# Altium project PEPL.PrjPcb
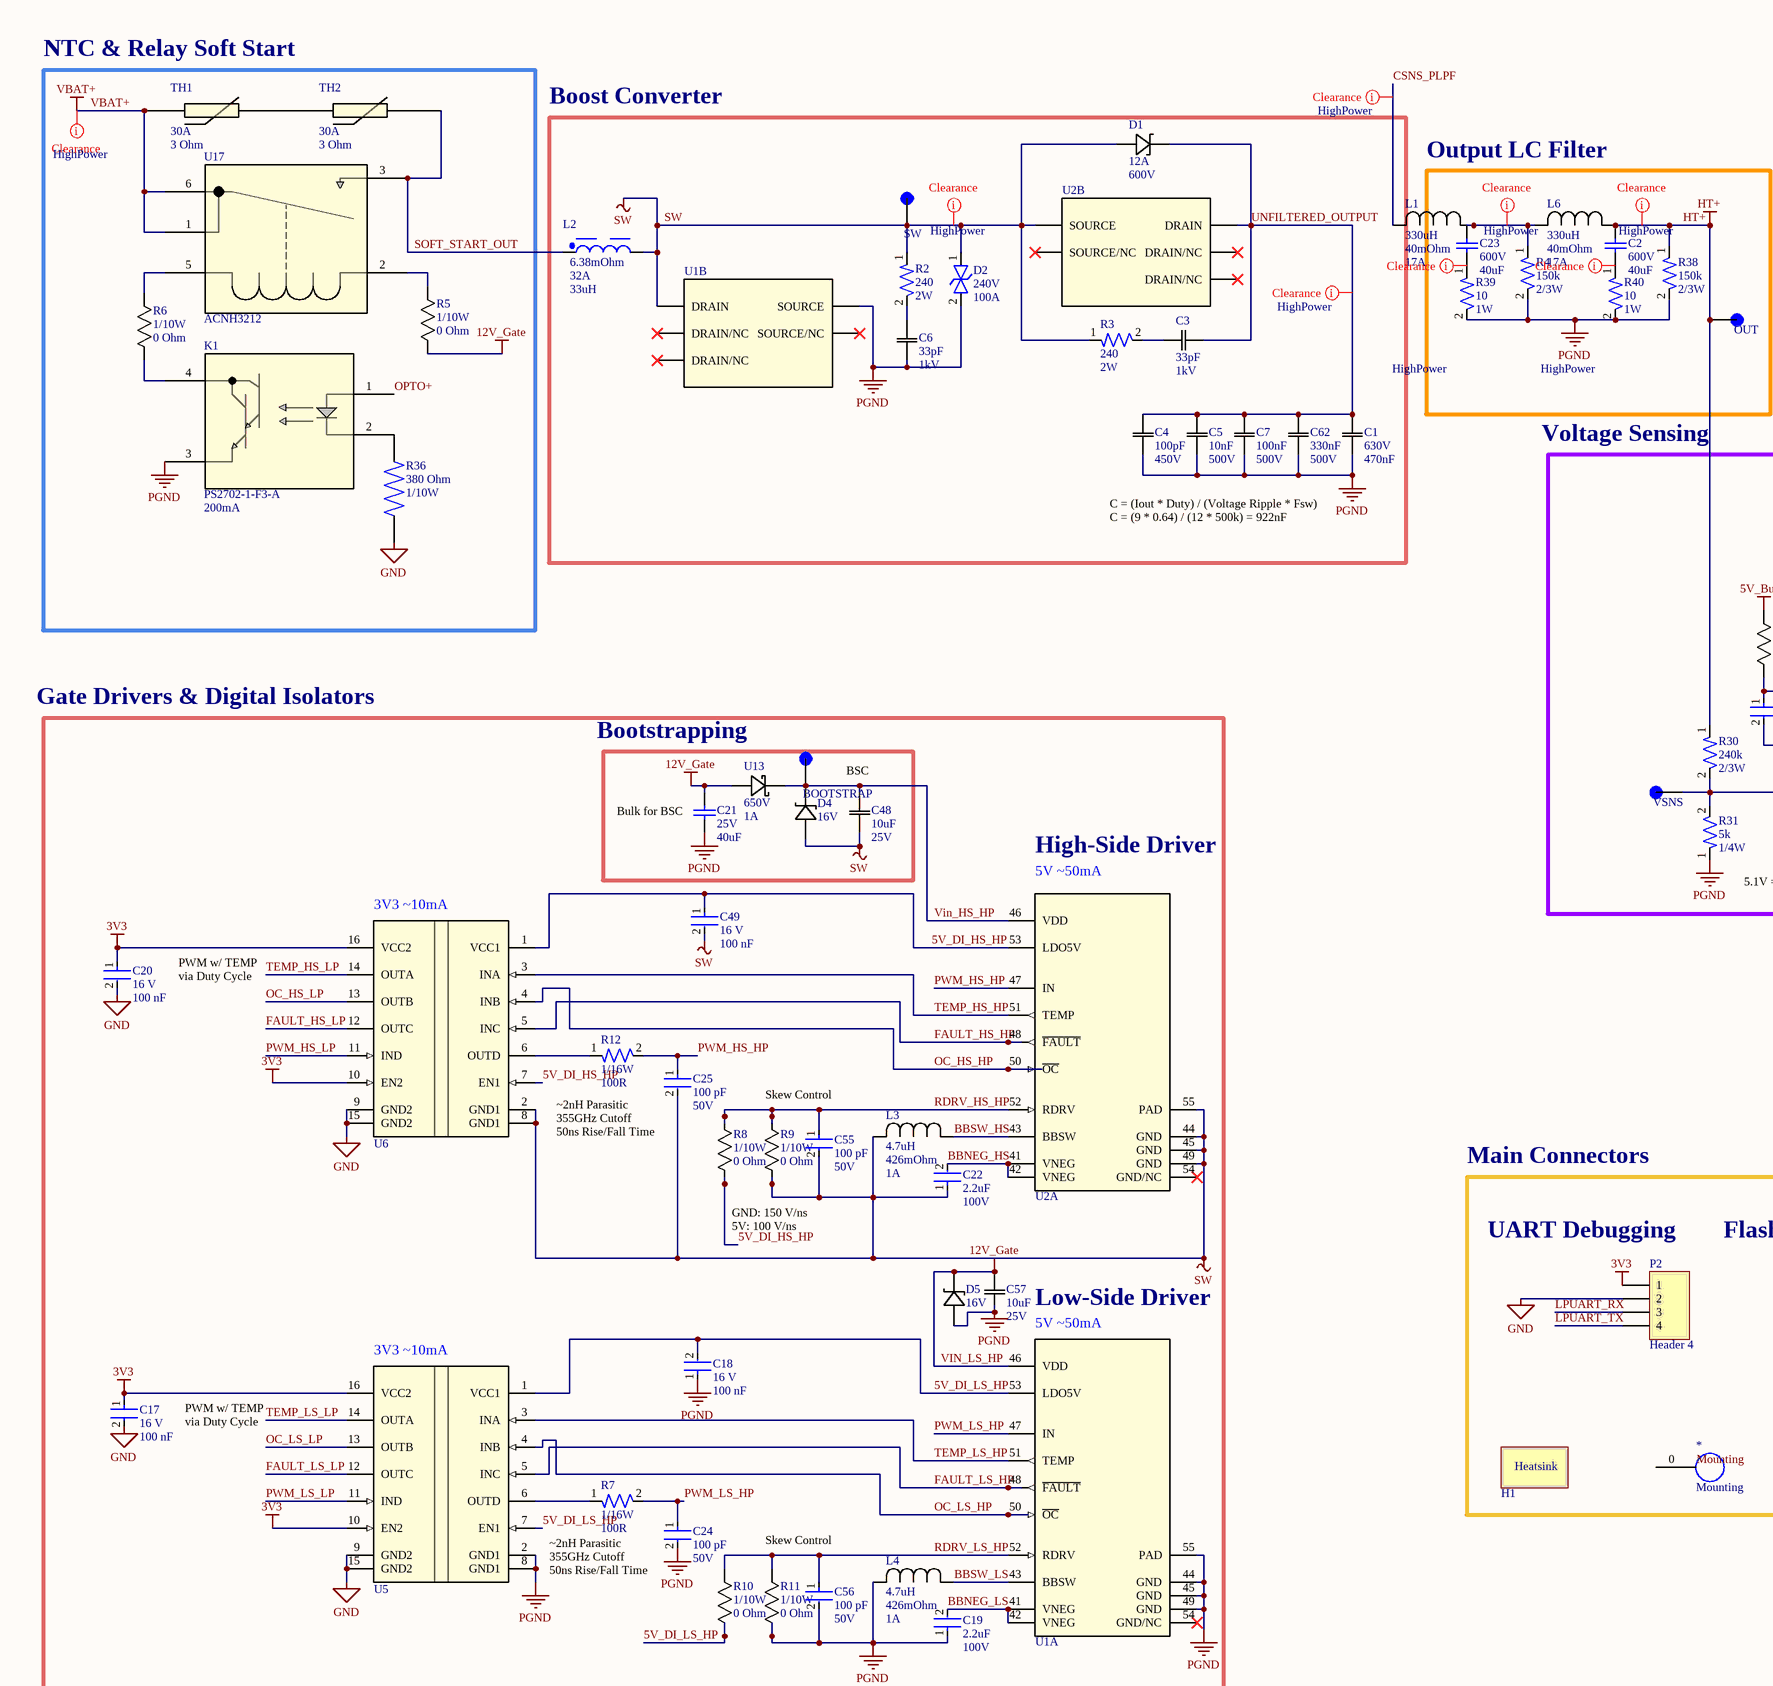
[diagram p0: Main.SchDoc, top left]
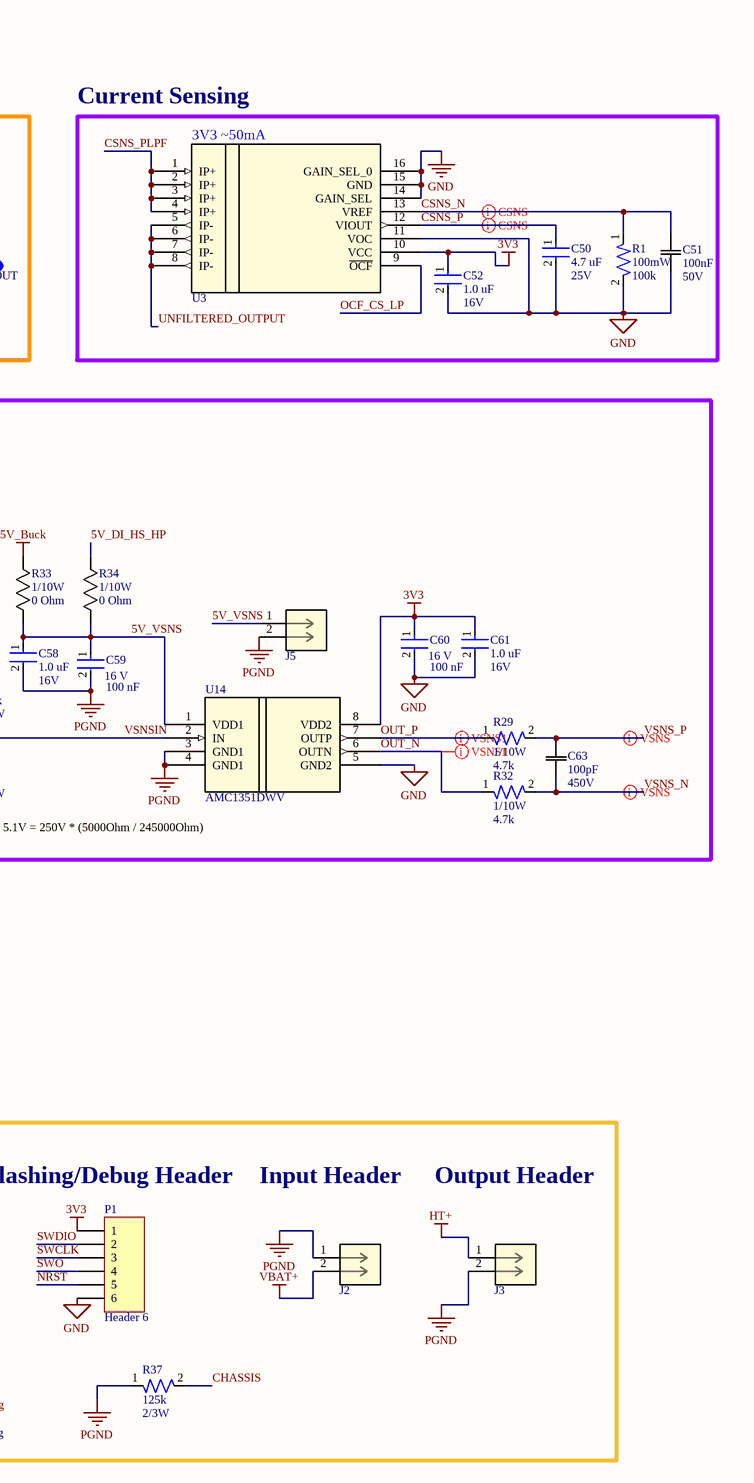
[diagram p1: Main.SchDoc, top right]
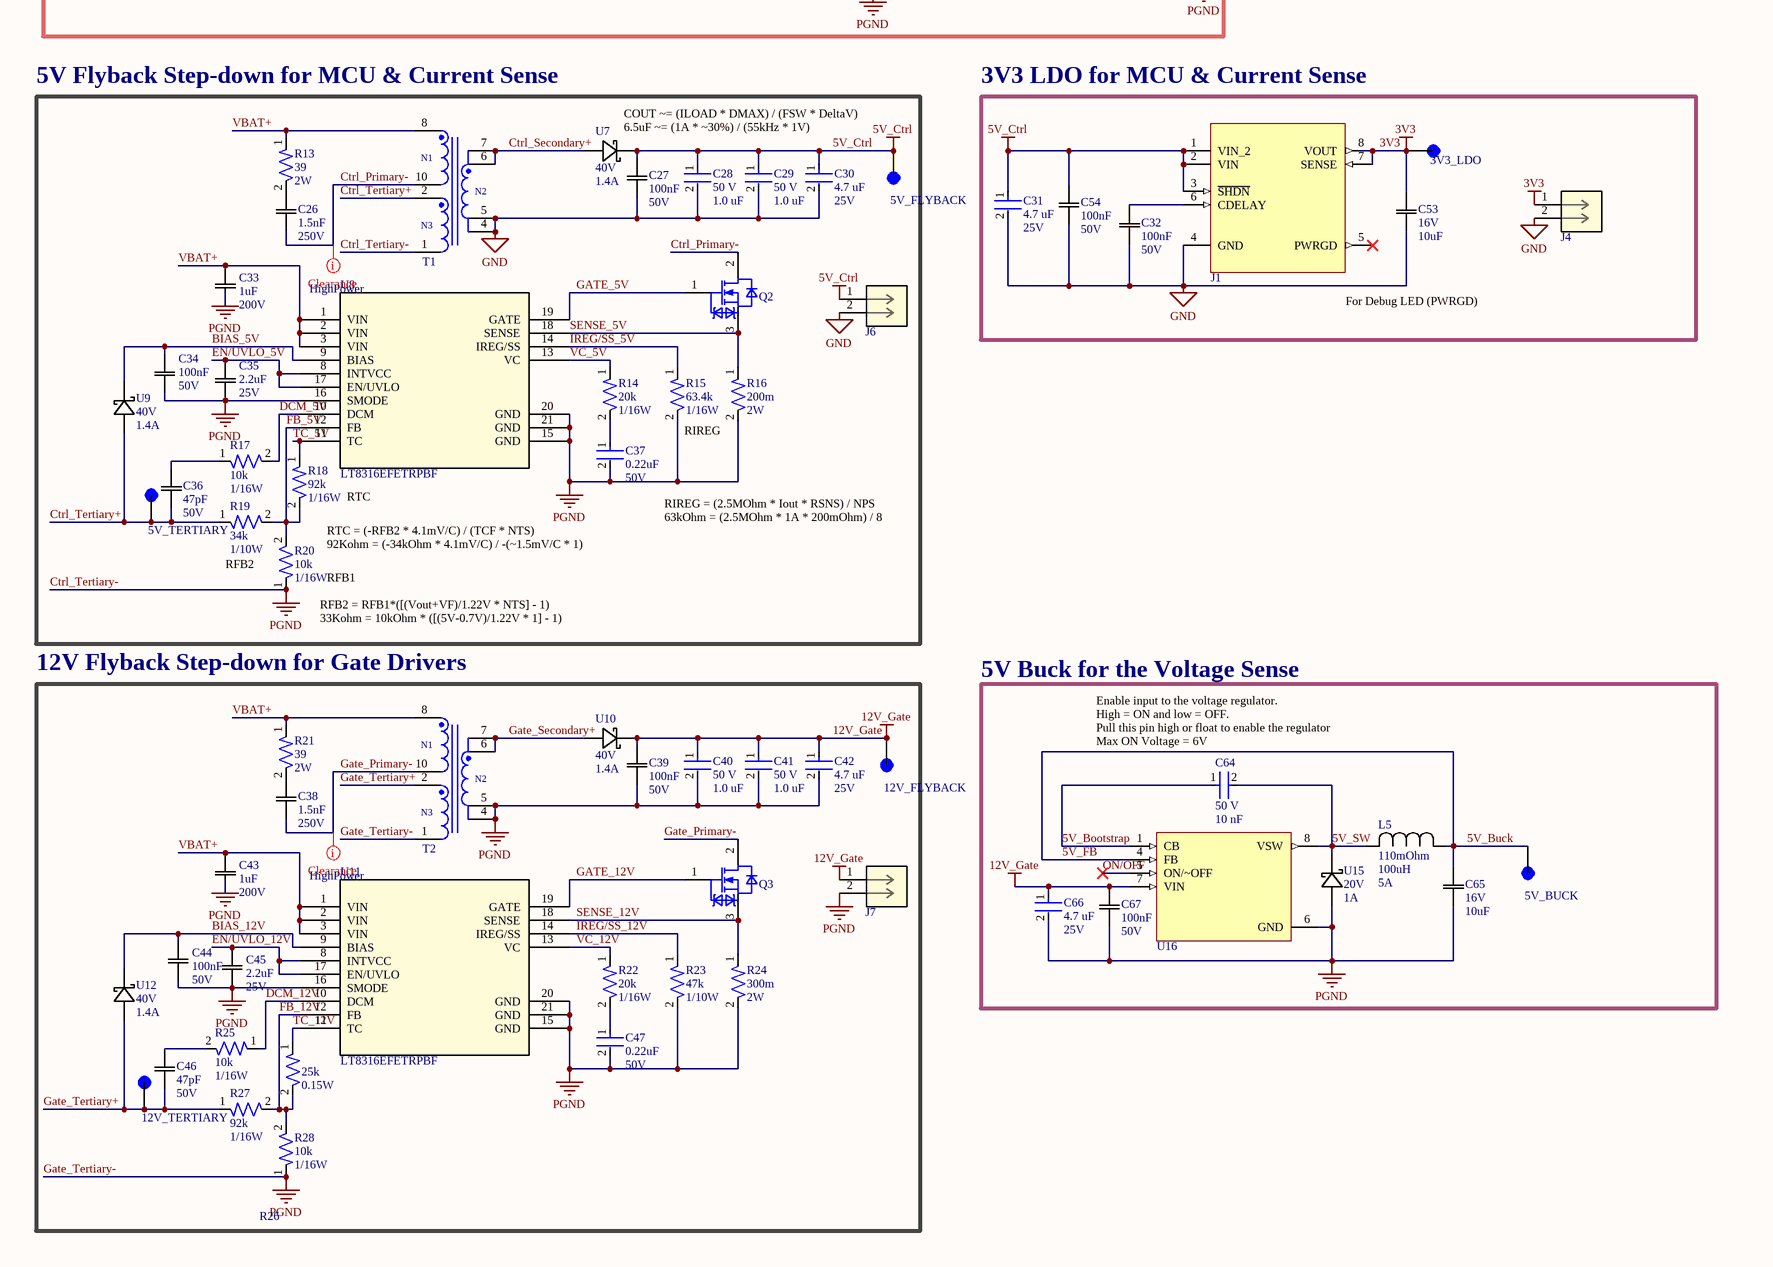
[diagram p2: Main.SchDoc, bottom left]
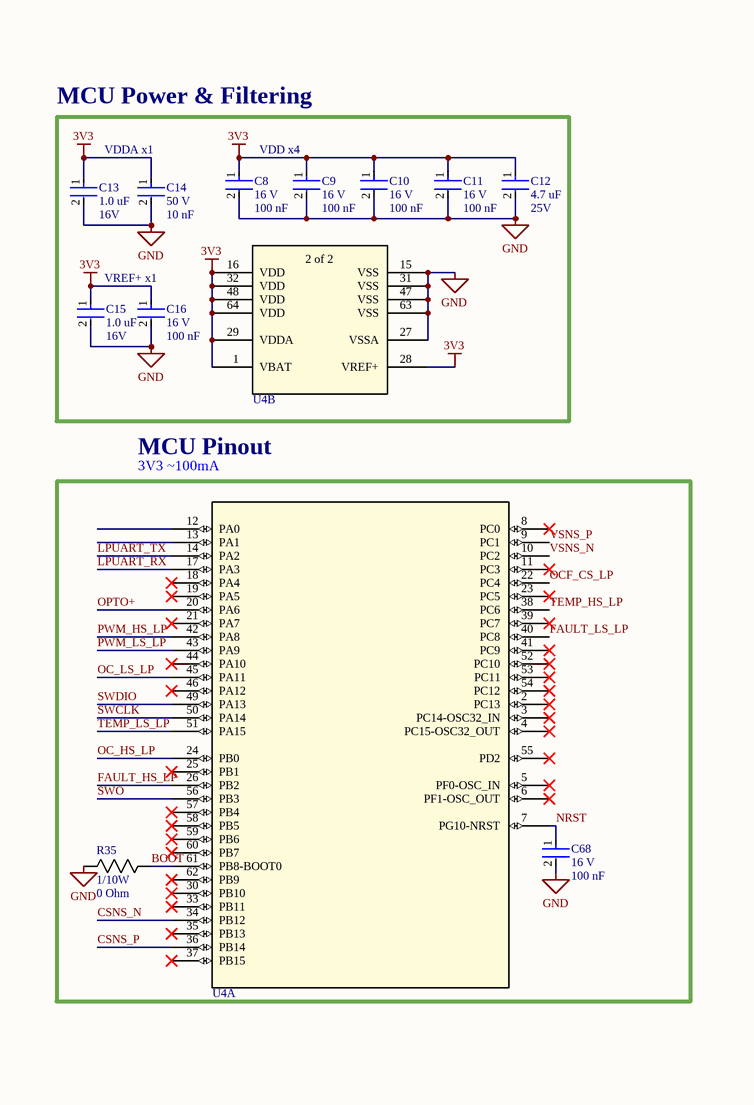
[diagram p3: Main.SchDoc, bottom right]
1 sheet, 163 parts. Net scope: global (net labels, ports and power ports of the same name join across sheets).
Board file: Main.PcbDoc

## Sheet Main.SchDoc
size 500 x 599 mm; SheetNumber: 1; SheetTotal: 1

### Parts
3V3_LDO  5016  [KEYSTONE_5016]  (value not drawn)
5V_BUCK  5016  [KEYSTONE_5016]  (value not drawn)
5V_FLYBACK  5016  [KEYSTONE_5016]  (value not drawn)
5V_TERTIARY  5016  [KEYSTONE_5016]  (value not drawn)
12V_FLYBACK  5016  [KEYSTONE_5016]  (value not drawn)
12V_TERTIARY  5016  [KEYSTONE_5016]  (value not drawn)
*  Mounting  [Mounting]
BOOTSTRAP  5016  [KEYSTONE_5016]  (value not drawn)
C1  Voltage: 630V  Capacitance: 470nF  [G-55_MUR]  (hidden comment: GRM55DR7LV474KW01K)
C2  Voltage: 600V  Capacitance: 40uF  [WCAP-FTDB_L42W30H45]  (hidden comment: 890764428004CS)
C3  Parameter 1: 33pF  Parameter 2: 1kV  [CAPC220145_140N_KEM-L]  (hidden comment: C0805C330JDGACTU)
C4  Capacitance: 100pF  Voltage: 450V  [CAP_2012_TDK]  (hidden comment: C2012C0G2W101J060AA)
C5  Capacitance: 10nF  Voltage: 500V  [CAPC3216X170N]  (hidden comment: VJ1206Y103KXEMT)
C6  Parameter 1: 33pF  Parameter 2: 1kV  [CAPC220145_140N_KEM-L]  (hidden comment: C0805C330JDGACTU)
C7  Capacitance: 100nF  Voltage: 500V  [CAPC340270_230N_KEM]  (hidden comment: C1210C104KCRACTU)
C8  Voltage Rating: 16 V  Capacitance: 100 nF  [CAP-0402]  (hidden comment: CC0402KRX7R7BB104)
C9  Voltage Rating: 16 V  Capacitance: 100 nF  [CAP-0402]  (hidden comment: CC0402KRX7R7BB104)
C10  Voltage Rating: 16 V  Capacitance: 100 nF  [CAP-0402]  (hidden comment: CC0402KRX7R7BB104)
C11  Voltage Rating: 16 V  Capacitance: 100 nF  [CAP-0402]  (hidden comment: CC0402KRX7R7BB104)
C12  Capacitance: 4.7 uF  Voltage: 25V  [CAP-0603]  (hidden comment: CC0603KRX5R8BB475)
C13  Capacitance: 1.0 uF  Voltage: 16V  [CAP-0603]  (hidden comment: CC0603KRX7R7BB105)
C14  Voltage: 50 V  Capacitance: 10 nF  [CAP-0603]  (hidden comment: CC0603KPX7R9BB103)
C15  Capacitance: 1.0 uF  Voltage: 16V  [CAP-0603]  (hidden comment: CC0603KRX7R7BB105)
C16  Voltage Rating: 16 V  Capacitance: 100 nF  [CAP-0402]  (hidden comment: CC0402KRX7R7BB104)
C17  Voltage Rating: 16 V  Capacitance: 100 nF  [CAP-0402]  (hidden comment: CC0402KRX7R7BB104)
C18  Voltage Rating: 16 V  Capacitance: 100 nF  [CAP-0402]  (hidden comment: CC0402KRX7R7BB104)
C19  Capacitance: 2.2uF  Voltage: 100V  [CAP-1206]  (hidden comment: CC1206KKX7R0BB225)
C20  Voltage Rating: 16 V  Capacitance: 100 nF  [CAP-0402]  (hidden comment: CC0402KRX7R7BB104)
C21  Voltage: 25V  Capacitance: 40uF  [CAPC3216X180N]  (hidden comment: C3216X5R1E476M160AC)
C22  Capacitance: 2.2uF  Voltage: 100V  [CAP-1206]  (hidden comment: CC1206KKX7R0BB225)
C23  Voltage: 600V  Capacitance: 40uF  [WCAP-FTDB_L42W30H45]  (hidden comment: 890764428004CS)
C24  Capacitance: 100 pF  Voltage: 50V  [CAP-0402]  (hidden comment: CC0402JRNPO9BN101)
C25  Capacitance: 100 pF  Voltage: 50V  [CAP-0402]  (hidden comment: CC0402JRNPO9BN101)
C26  Parameter 1: 1.5nF  Parameter 2: 250V  [CAPC17595_92N_KEM]  (hidden comment: C0603C152JAGACAUTO)
C27  Capacitance: 100nF  Voltage: 50V  [YAG_CC0603_YAG]  (hidden comment: CC0603KRX7R9BB104)
C28  Voltage: 50 V  Capacitance: 1.0 uF  [CAP-0805]  (hidden comment: CC0805KKX7R9BB105)
C29  Voltage: 50 V  Capacitance: 1.0 uF  [CAP-0805]  (hidden comment: CC0805KKX7R9BB105)
C30  Capacitance: 4.7 uF  Voltage: 25V  [CAP-0603]  (hidden comment: CC0603KRX5R8BB475)
C31  Capacitance: 4.7 uF  Voltage: 25V  [CAP-0603]  (hidden comment: CC0603KRX5R8BB475)
C32  Capacitance: 100nF  Voltage: 50V  [YAG_CC0603_YAG]  (hidden comment: CC0603KRX7R9BB104)
C33  Capacitance: 1uF  Voltage: 200V  [CAPC4532X279N]  (hidden comment: 18122C105KAT2A)
C34  Capacitance: 100nF  Voltage: 50V  [YAG_CC0603_YAG]  (hidden comment: CC0603KRX7R9BB104)
C35  Capacitance: 2.2uF  Voltage: 25V  [CAPC1005X70N]  (hidden comment: GRM155R61E225KE11D)
C36  Capacitance: 47pF  Voltage: 50V  [CAPC10555_55N_KEM]  (hidden comment: C0402C470F5GACTU)
C37  Capacitance: 0.22uF  Voltage: 50V  [CAP-0603]  (hidden comment: CC0603JRX7R9BB224)
C38  Parameter 1: 1.5nF  Parameter 2: 250V  [CAPC17595_92N_KEM]  (hidden comment: C0603C152JAGACAUTO)
C39  Capacitance: 100nF  Voltage: 50V  [YAG_CC0603_YAG]  (hidden comment: CC0603KRX7R9BB104)
C40  Voltage: 50 V  Capacitance: 1.0 uF  [CAP-0805]  (hidden comment: CC0805KKX7R9BB105)
C41  Voltage: 50 V  Capacitance: 1.0 uF  [CAP-0805]  (hidden comment: CC0805KKX7R9BB105)
C42  Capacitance: 4.7 uF  Voltage: 25V  [CAP-0603]  (hidden comment: CC0603KRX5R8BB475)
C43  Capacitance: 1uF  Voltage: 200V  [CAPC4532X279N]  (hidden comment: 18122C105KAT2A)
C44  Capacitance: 100nF  Voltage: 50V  [YAG_CC0603_YAG]  (hidden comment: CC0603KRX7R9BB104)
C45  Capacitance: 2.2uF  Voltage: 25V  [CAPC1005X70N]  (hidden comment: GRM155R61E225KE11D)
C46  Capacitance: 47pF  Voltage: 50V  [CAPC10555_55N_KEM]  (hidden comment: C0402C470F5GACTU)
C47  Capacitance: 0.22uF  Voltage: 50V  [CAP-0603]  (hidden comment: CC0603JRX7R9BB224)
C48  Capacitance: 10uF  Voltage: 25V  [CAPC1608X100N]  (hidden comment: GRM188R61E106KA73D)
C49  Voltage Rating: 16 V  Capacitance: 100 nF  [CAP-0402]  (hidden comment: CC0402KRX7R7BB104)
C50  Capacitance: 4.7 uF  Voltage: 25V  [CAP-0603]  (hidden comment: CC0603KRX5R8BB475)
C51  Capacitance: 100nF  Voltage: 50V  [YAG_CC0603_YAG]  (hidden comment: CC0603KRX7R9BB104)
C52  Capacitance: 1.0 uF  Voltage: 16V  [CAP-0603]  (hidden comment: CC0603KRX7R7BB105)
C53  Voltage: 16V  Capacitance: 10uF  [CAPC1608X100N]  (hidden comment: GRM188C81C106MA73D)
C54  Capacitance: 100nF  Voltage: 50V  [YAG_CC0603_YAG]  (hidden comment: CC0603KRX7R9BB104)
C55  Capacitance: 100 pF  Voltage: 50V  [CAP-0402]  (hidden comment: CC0402JRNPO9BN101)
C56  Capacitance: 100 pF  Voltage: 50V  [CAP-0402]  (hidden comment: CC0402JRNPO9BN101)
C57  Capacitance: 10uF  Voltage: 25V  [CAPC1608X100N]  (hidden comment: GRM188R61E106KA73D)
C58  Capacitance: 1.0 uF  Voltage: 16V  [CAP-0603]  (hidden comment: CC0603KRX7R7BB105)
C59  Voltage Rating: 16 V  Capacitance: 100 nF  [CAP-0402]  (hidden comment: CC0402KRX7R7BB104)
C60  Voltage Rating: 16 V  Capacitance: 100 nF  [CAP-0402]  (hidden comment: CC0402KRX7R7BB104)
C61  Capacitance: 1.0 uF  Voltage: 16V  [CAP-0603]  (hidden comment: CC0603KRX7R7BB105)
C62  Capacitance: 330nF  Voltage: 500V  [CAPC480350_230N_KEM]  (hidden comment: C1812C334KCRACAUTO)
C63  Capacitance: 100pF  Voltage: 450V  [CAP_2012_TDK]  (hidden comment: C2012C0G2W101J060AA)
C64  Voltage: 50 V  Capacitance: 10 nF  [CAP-0603]  (hidden comment: CC0603KPX7R9BB103)
C65  Voltage: 16V  Capacitance: 10uF  [CAPC1608X100N]  (hidden comment: GRM188C81C106MA73D)
C66  Capacitance: 4.7 uF  Voltage: 25V  [CAP-0603]  (hidden comment: CC0603KRX5R8BB475)
C67  Capacitance: 100nF  Voltage: 50V  [YAG_CC0603_YAG]  (hidden comment: CC0603KRX7R9BB104)
C68  Voltage Rating: 16 V  Capacitance: 100 nF  [CAP-0402]  (hidden comment: CC0402KRX7R7BB104)
D1  Parameter 2: 12A  Parameter 1: 600V  [TO-220AC_STM]  (hidden comment: STTH12R06D)
D2  Standoff Voltage: 240V  Current Rating: 100A  [DIO-SOD128]  (hidden comment: PTVS1-240C-M)
D4  Parameter 2: 16V  [SOD-323_1P8X1P35_ONS-L]  (hidden comment: MM3Z16VT1G)
D5  Parameter 2: 16V  [SOD-323_1P8X1P35_ONS-L]  (hidden comment: MM3Z16VT1G)
H1  HEATSINK-1  [Heatsink-1]  (value not drawn)
J1  MCP1727T-3302E/SN  [SOIC127P490X175-8N]  (value not drawn)
J2  393800102  [CONN2_0393800102_524x492_MOL]  (value not drawn)
J3  393800102  [CONN2_0393800102_524x492_MOL]  (value not drawn)
J4  Custom  [CONN-THROUGHHOLE]  (value not drawn)
J5  Custom  [CONN-THROUGHHOLE]  (value not drawn)
J6  Custom  [CONN-THROUGHHOLE]  (value not drawn)
J7  Custom  [CONN-THROUGHHOLE]  (value not drawn)
K1  PS2702-1-F3-A  Parameter 1: 200mA  [SO4_PS2702-1_REN-M]
L1  Parameter 1: 330uH  Parameter 2: 40mOhm  Parameter 3: 17A  [FilterInd330uH]  (hidden comment: RL-1256-6-330)
L2  Parameter 1: 6.38mOhm  Parameter 2: 32A  Parameter 3: 33uH  [WE-HCFT_3540_7443763540330]  (hidden comment: 7443763540330)
L3  Parameter 1: 4.7uH  Parameter 2: 426mOhm  Parameter 3: 1A  [IND-4.7uH]  (hidden comment: B82559A0203A024)
L4  Parameter 1: 4.7uH  Parameter 2: 426mOhm  Parameter 3: 1A  [IND-4.7uH]  (hidden comment: B82559A0203A024)
L5  Parameter 3: 110mOhm  Parameter 1: 100uH  Parameter 2: 5A  [IND_IHLP-6767GZ_VIS]  (hidden comment: IHLP6767GZER101M11)
L6  Parameter 1: 330uH  Parameter 2: 40mOhm  Parameter 3: 17A  [FilterInd330uH]  (hidden comment: RL-1256-6-330)
OUT  5016  [KEYSTONE_5016]  (value not drawn)
P1  Header 6  [HDR1X6]
P2  Header 4  [HDR1X4]
Q2  IPD80R450P7  [TO229P994X256-3N-V]  (value not drawn)
Q3  IPD80R450P7  [TO229P994X256-3N-V]  (value not drawn)
R1  Power: 100mW  Resistance: 100k  [RES-0603]  (hidden comment: RC0603FR-07100KL)
R2  Resistance: 240  Power: 2W  [RESC6332X65N]  (hidden comment: 3521240RFT)
R3  Resistance: 240  Power: 2W  [RESC6332X65N]  (hidden comment: 3521240RFT)
R4  Resistance: 150k  Power: 2/3W  [RES_ERJP08J154V]  (hidden comment: ERJ-P08J154V)
R5  Parameter 2: 1/10W  Parameter 1: 0 Ohm  [RC0603N_YAG]  (hidden comment: RC0603JR-070RL)
R6  Parameter 2: 1/10W  Parameter 1: 0 Ohm  [RC0603N_YAG]  (hidden comment: RC0603JR-070RL)
R7  Power: 1/16W  Resistance: 100R  [RES-0402]  (hidden comment: RC0402FR-07100RL)
R8  Parameter 2: 1/10W  Parameter 1: 0 Ohm  [RC0603N_YAG]  (hidden comment: RC0603JR-070RL)
R9  Parameter 2: 1/10W  Parameter 1: 0 Ohm  [RC0603N_YAG]  (hidden comment: RC0603JR-070RL)
R10  Parameter 2: 1/10W  Parameter 1: 0 Ohm  [RC0603N_YAG]  (hidden comment: RC0603JR-070RL)
R11  Parameter 2: 1/10W  Parameter 1: 0 Ohm  [RC0603N_YAG]  (hidden comment: RC0603JR-070RL)
R12  Power: 1/16W  Resistance: 100R  [RES-0402]  (hidden comment: RC0402FR-07100RL)
R13  Resistance: 39  Power: 2W  [RESC6332X65N]  (hidden comment: CRGP2512F39R)
R14  Resistance: 20k  Power: 1/16W  [RESC1005X40N]  (hidden comment: ERA-2AEB203X)
R15  Resistance: 63.4k  Power: 1/16W  [RESC1005X40N]  (hidden comment: RC0402FR-0763K4L)
R16  Resistance: 200m  Power: 2W  [RESC6331X80N]  (hidden comment: CRM2512-JX-R200ELF)
R17  Resistance: 10k  Power: 1/16W  [RESC1005X40N]  (hidden comment: CRCW040210K0FKED)
R18  Resistance: 92k  Power: 1/16W  [RESC1005X35N]  (hidden comment: RT0402BRD0792KL)
R19  Resistance: 34k  Power: 1/10W  [RES_ERJ2RKF3402X]  (hidden comment: ERJ-2RKF3402X)
R20  Resistance: 10k  Power: 1/16W  [RESC1005X40N]  (hidden comment: CRCW040210K0FKED)
R21  Resistance: 39  Power: 2W  [RESC6332X65N]  (hidden comment: CRGP2512F39R)
R22  Resistance: 20k  Power: 1/16W  [RESC1005X40N]  (hidden comment: ERA-2AEB203X)
R23  Resistance: 47k  Power: 1/10W  [RES_ERJ2RKF4702X]  (hidden comment: ERJ-2RKF4702X)
R24  Resistance: 300m  Power: 2W  [STA_CSRN2512_STP]  (hidden comment: CSRN2512FKR300)
R25  Resistance: 10k  Power: 1/16W  [RESC1005X40N]  (hidden comment: CRCW040210K0FKED)
R26  Resistance: 25k  Power: 0.15W  [0603_VIS]  (hidden comment: PNM0603E2502BST5)
R27  Resistance: 92k  Power: 1/16W  [RESC1005X35N]  (hidden comment: RT0402BRD0792KL)
R28  Resistance: 10k  Power: 1/16W  [RESC1005X40N]  (hidden comment: CRCW040210K0FKED)
R29  Power: 1/10W  Resistance: 4.7k  [RES-0603]  (hidden comment: RC0603FR-074K7L)
R30  Resistance: 240k  Power: 2/3W  [RES_ERJP08F2403V]  (hidden comment: ERJ-P08F2403V)
R31  Resistance: 5k  Power: 1/4W  [RESC3116X65N]  (hidden comment: RT1206BRD075KL)
R32  Power: 1/10W  Resistance: 4.7k  [RES-0603]  (hidden comment: RC0603FR-074K7L)
R33  Parameter 2: 1/10W  Parameter 1: 0 Ohm  [RC0603N_YAG]  (hidden comment: RC0603JR-070RL)
R34  Parameter 2: 1/10W  Parameter 1: 0 Ohm  [RC0603N_YAG]  (hidden comment: RC0603JR-070RL)
R35  Parameter 2: 1/10W  Parameter 1: 0 Ohm  [RC0603N_YAG]  (hidden comment: RC0603JR-070RL)
R36  Parameter 1: 380 Ohm  Parameter 2: 1/10W  [RESC1608X55N]  (hidden comment: RN73H1JTTD3790D100)
R37  Resistance: 125k  Power: 2/3W  [RES_ERJP08J154V]  (hidden comment: ERJ-P08J154V)
R38  Resistance: 150k  Power: 2/3W  [RES_ERJP08J154V]  (hidden comment: ERJ-P08J154V)
R39  Resistance: 10  Power: 1W  [RESC6331X65N]  (hidden comment: RC2512FK-0710RL)
R40  Resistance: 10  Power: 1W  [RESC6331X65N]  (hidden comment: RC2512FK-0710RL)
SW  5016  [KEYSTONE_5016]  (value not drawn)
T1  750317589  [RM10_750317589]  (value not drawn)
T2  750317589  [RM10_750317589]  (value not drawn)
TH1  Parameter 2: 30A  Parameter 1: 3 Ohm  [MS35 3R030_AMT]  (hidden comment: MS35 3R030)
TH2  Parameter 2: 30A  Parameter 1: 3 Ohm  [MS35 3R030_AMT]  (hidden comment: MS35 3R030)
U1  LMG3422R030RQZT  [RQZ0054A-MFG]  (value not drawn)  (parts A,B of 2)
U2  LMG3422R030RQZT  [RQZ0054A-MFG]  (value not drawn)  (parts A,B of 2)
U3  ACS37002LLAATR-015B3  [SOIC_TR-050B5_ALM]  (value not drawn)
U4  STM32G474RET6  [LQFP64-10x10mm]  (value not drawn)  (parts A,B of 2)
U5  ISO7741FDBQR  [DBQ0016A_L]  (value not drawn)
U6  ISO7741FDBQR  [DBQ0016A_L]  (value not drawn)
U7  Parameter 1: 40V  Parameter 2: 1.4A  [CDBA-HF]  (hidden comment: CDBA140SL-HF)
U8  LT8316EFETRPBF  [05-08-1990_ADI]
U9  Parameter 1: 40V  Parameter 2: 1.4A  [CDBA-HF]  (hidden comment: CDBA140SL-HF)
U10  Parameter 1: 40V  Parameter 2: 1.4A  [CDBA-HF]  (hidden comment: CDBA140SL-HF)
U11  LT8316EFETRPBF  [05-08-1990_ADI]
U12  Parameter 1: 40V  Parameter 2: 1.4A  [CDBA-HF]  (hidden comment: CDBA140SL-HF)
U13  Parameter 1: 650V  Parameter 2: 1A  [DIO-SHOT-650V-1A]  (hidden comment: GB01SLT06-214)
U14  AMC1351DWV  [SOIC8_DWV_TEX-M]
U15  Parameter 1: 20V  Parameter 2: 1A  [DO-214AC_SMA]  (hidden comment: SK12)
U16  LM2674MX-5.0/NOPB  [SOIC127P490X175-8N]  (value not drawn)
U17  ACNH3212  [RELAY_ACNH_PAN]
VSNS  5016  [KEYSTONE_5016]  (value not drawn)

### Blocks framed on the sheet
NTC & Relay Soft Start: K1 R5 R6 R36 TH1 TH2 U17
Boost Converter: C1 C3-C7 C62 D1 D2 L2 R2 R3 SW U1 U2
Output LC Filter: C2 C23 L1 L6 OUT R4 R38-R40
Current Sensing: C50-C52 R1 U3
5V Flyback Step-down for MCU & Current Sense: 5V_FLYBACK 5V_TERTIARY C26-C30 C33-C37 J6 Q2 R13-R20 T1 U7-U9
3V3 LDO for MCU & Current Sense: 3V3_LDO C31 C32 C53 C54 J1 J4
MCU Power & Filtering: C8-C16 U4
3V3 ~100mA: C68 R35 U4
12V Flyback Step-down for Gate Drivers: 12V_FLYBACK 12V_TERTIARY C38-C47 J7 Q3 R21-R28 T2 U10-U12
5V Buck for the Voltage Sense: 5V_BUCK C64-C67 L5 U15 U16

### Nets
3V3: 3V3_LDO.TP C8.1 C9.1 C10.1 C11.1 C12.1 C13.1 C14.1 C15.1 C16.1 C17.1 C20.1 C52.1 C53.2 C60.1 C61.1 J1.7(SENSE) J1.8(VOUT) J4.1 P1.1 P2.1 U3.10(VCC) U4.1(VBAT) U4.16(VDD) U4.28(VREF+) U4.29(VDDA) U4.32(VDD) U4.48(VDD) U4.64(VDD) U5.10(EN2) U5.16(VCC2) U6.10(EN2) U6.16(VCC2) U14.8(VDD2)
5V_Buck: 5V_BUCK.TP C65.2 L5.1 R33.2 U16.4(FB)  [also labelled 5V_FB]
5V_Ctrl: 5V_FLYBACK.TP C27.2 C28.1 C29.1 C30.1 C31.1 C54.2 J1.1(VIN_2) J1.2(VIN) J1.3(~{SHDN}) J6.1 U7.1
12V_Gate: 12V_FLYBACK.TP C21.2 C39.2 C40.1 C41.1 C42.1 C57.2 C66.1 C67.2 D5.1(A) J7.1 R5.2 U1.46(VDD) U10.1 U13.2 U16.7(VIN)  [also labelled VIN_LS_HP]
GND: C8.2 C9.2 C10.2 C11.2 C12.2 C13.2 C14.2 C15.2 C16.2 C17.2 C20.2 C27.1 C28.2 C29.2 C30.2 C31.2 C32.1 C50.2 C51.1 C52.2 C53.1 C54.1 C60.2 C61.2 C68.2 J1.4(GND) J4.2 J6.2 P1.6 P2.2 R1.2 R35.1 R36.1 T1.4 T1.5 U3.11(VOC) U3.14(GAIN_SEL) U3.15(GND) U3.16(GAIN_SEL_0) U4.15(VSS) U4.27(VSSA) U4.31(VSS) U4.47(VSS) U4.63(VSS) U5.9(GND2) U5.15(GND2) U6.9(GND2) U6.15(GND2) U14.5(GND2)
HT+: C2.2 J3.1 L6.1 OUT.TP R30.1 R38.1
PGND: C1.1 C4.1 C5.1 C6.1 C7.1 C18.1 C19.1 C21.1 C24.2 C33.1 C34.1 C35.2 C37.2 C39.1 C40.2 C41.2 C42.2 C43.1 C44.1 C45.2 C47.2 C56.2 C57.1 C58.2 C59.2 C62.1 C65.1 C66.2 C67.1 D2.2 D5.2(K) J2.1 J3.2 J5.2 J7.2 K1.3 L4.2 R4.2 R11.2 R15.2 R16.2 R20.1 R23.2 R24.2 R28.1 R31.1 R37.1 R38.2 R39.2 R40.2 T1.1 T2.1 T2.4 T2.5 U1.18,19,20,21,22,23,24,25,26,27,28,29,30,31,32,33,34,35,36,37,38,39,40(SOURCE) U1.44(GND) U1.45(GND) U1.49(GND) U1.55(PAD) U5.2(GND1) U5.8(GND1) U8.15(GND) U8.16(SMODE) U8.20(GND) U8.21(GND) U11.15(GND) U11.16(SMODE) U11.20(GND) U11.21(GND) U14.3(GND1) U14.4(GND1) U15.a U16.6(GND)  [also labelled Ctrl_Tertiary-, Gate_Tertiary-]
SW: C22.1 C25.2 C48.1 C49.2 C55.2 D1.1(K) D2.1 D4.2(K) L2.2 L3.2 R2.1 R3.1 R9.2 SW.TP U1.2,3,4,5,6,7,8,9,10,11,12,13,14,15(DRAIN) U2.18,19,20,21,22,23,24,25,26,27,28,29,30,31,32,33,34,35,36,37,38,39,40(SOURCE) U2.44(GND) U2.45(GND) U2.49(GND) U2.55(PAD) U6.2(GND1) U6.8(GND1)
VBAT+: C33.2 C43.2 J2.2 R13.1 R21.1 T1.8 T2.8 TH1.1 U8.1(VIN) U8.2(VIN) U8.3(VIN) U11.1(VIN) U11.2(VIN) U11.3(VIN) U17.1 U17.6
5V_Bootstrap: C64.1 U16.1(CB)
5V_DI_HS_HP: C49.1 R8.2 R34.2 U2.53(LDO5V) U6.1(VCC1) U6.7(EN1)
5V_DI_LS_HP: C18.2 R10.2 U1.53(LDO5V) U5.1(VCC1) U5.7(EN1)
5V_SW: C64.2 L5.2 U15.k U16.8(VSW)
5V_VSNS: C58.1 C59.1 J5.1 R33.1 R34.1 U14.1(VDD1)
BBNEG_HS: C22.2 U2.41(VNEG) U2.42(VNEG)
BBNEG_LS: C19.2 U1.41(VNEG) U1.42(VNEG)
BBSW_HS: L3.1 U2.43(BBSW)
BBSW_LS: L4.1 U1.43(BBSW)
BIAS_5V: C34.2 U8.9(BIAS) U9.1
BIAS_12V: C44.2 U11.9(BIAS) U12.1
BOOT: R35.2 U4.61(PB8-BOOT0)
CHASSIS: R37.2
CSNS_N: C51.2 R1.1 U3.13(VREF) U4.34(PB12)
CSNS_P: C50.1 U3.12(VIOUT) U4.36(PB14)
CSNS_PLPF: L1.2 U3.1(IP+) U3.2(IP+) U3.3(IP+) U3.4(IP+)
Ctrl_Primary-: C26.2 Q2.2(DRAIN) T1.10
Ctrl_Secondary+: T1.6 T1.7 U7.2
Ctrl_Tertiary+: 5V_TERTIARY.TP C36.2 R19.1 T1.2 U9.2
DCM_5V: R17.2 U8.10(DCM)
DCM_12V: R25.1 U11.10(DCM)
EN/UVLO_5V: C35.1 U8.8(INTVCC) U8.17(EN/UVLO)
EN/UVLO_12V: C45.1 U11.8(INTVCC) U11.17(EN/UVLO)
FAULT_HS_HP: U2.48(~{FAULT}) U6.5(INC)
FAULT_HS_LP: U4.26(PB2) U6.12(OUTC)
FAULT_LS_HP: U1.48(~{FAULT}) U5.5(INC)
FAULT_LS_LP: U4.40(PC8) U5.12(OUTC)
FB_5V: R18.2 R19.2 R20.2 U8.12(FB)
FB_12V: R26.2 R27.2 R28.2 U11.12(FB)
GATE_5V: Q2.1(GATE) U8.19(GATE)
GATE_12V: Q3.1(GATE) U11.19(GATE)
Gate_Primary-: C38.2 Q3.2(DRAIN) T2.10
Gate_Secondary+: T2.6 T2.7 U10.2
Gate_Tertiary+: 12V_TERTIARY.TP C46.2 R27.1 T2.2 U12.2
IREG/SS_5V: R15.1 U8.14(IREG/SS)
IREG/SS_12V: R23.1 U11.14(IREG/SS)
LPUART_RX: P2.3 U4.17(PA3)
LPUART_TX: P2.4 U4.14(PA2)
Mounting: *.0
NRST: C68.1 P1.5 U4.7(PG10-NRST)
OC_HS_HP: U2.50(~{OC}) U6.4(INB)
OC_HS_LP: U4.24(PB0) U6.13(OUTB)
OC_LS_HP: U1.50(~{OC}) U5.4(INB)
OC_LS_LP: U4.45(PA11) U5.13(OUTB)
OCF_CS_LP: U3.9(~{OCF}) U4.22(PC4)
ON/OFF: U16.5(ON/~OFF)
OPTO+: K1.1 U4.20(PA6)
OUT_N: R32.1 U14.6(OUTN)
OUT_P: R29.1 U14.7(OUTP)
PWM_HS_HP: C25.1 R12.2 U2.47(IN)
PWM_HS_LP: U4.42(PA8) U6.11(IND)
PWM_LS_HP: C24.1 R7.2 U1.47(IN)
PWM_LS_LP: U4.43(PA9) U5.11(IND)
RDRV_HS_HP: C55.1 R8.1 R9.1 U2.52(RDRV)
RDRV_LS_HP: C56.1 R10.1 R11.1 U1.52(RDRV)
SENSE_5V: Q2.3(SOURCE) R16.1 U8.18(SENSE)
SENSE_12V: Q3.3(SOURCE) R24.1 U11.18(SENSE)
SOFT_START_OUT: L2.1 TH2.2 U17.3
SWCLK: P1.3 U4.50(PA14)
SWDIO: P1.2 U4.49(PA13)
SWO: P1.4 U4.56(PB3)
TC_5V: R18.1 U8.11(TC)
TC_12V: R26.1 U11.11(TC)
TEMP_HS_HP: U2.51(TEMP) U6.3(INA)
TEMP_HS_LP: U4.38(PC6) U6.14(OUTA)
TEMP_LS_HP: U1.51(TEMP) U5.3(INA)
TEMP_LS_LP: U4.51(PA15) U5.14(OUTA)
UNFILTERED_OUTPUT: C1.2 C3.1 C4.2 C5.2 C7.2 C62.2 D1.2(A) U2.2,3,4,5,6,7,8,9,10,11,12,13,14,15(DRAIN) U3.5(IP-) U3.6(IP-) U3.7(IP-) U3.8(IP-)
VC_5V: R14.1 U8.13(VC)
VC_12V: R22.1 U11.13(VC)
Vin_HS_HP: BOOTSTRAP.TP C48.2 D4.1(A) U2.46(VDD) U13.1
VSNS_N: C63.1 R32.2 U4.10(PC2)
VSNS_P: C63.2 R29.2 U4.9(PC1)
VSNSIN: R30.2 R31.2 U14.2(IN) VSNS.TP
NetC2_1: C2.1 R40.1
NetC3_2: C3.2 R3.2
NetC6_2: C6.2 R2.2
NetC23_1: C23.1 R39.1
NetC23_2: C23.2 L1.1 L6.2 R4.1
NetC26_1: C26.1 R13.2
NetC32_2: C32.2 J1.6(CDELAY)
NetC36_1: C36.1 R17.1
NetC37_1: C37.1 R14.2
NetC38_1: C38.1 R21.2
NetC46_1: C46.1 R25.2
NetC47_1: C47.1 R22.2
NetK1_2: K1.2 R36.2
NetK1_4: K1.4 R6.2
NetR5_1: R5.1 U17.2(Coil+)
NetR6_1: R6.1 U17.5(Coil-)
NetR7_1: R7.1 U5.6(OUTD)
NetR12_1: R12.1 U6.6(OUTD)
NetTH1_2: TH1.2 TH2.1

Not connected (* = marked no-connect by the designer): J1 5(PWRGD)*; U1 1(DRAIN/NC)* 16(DRAIN/NC)* 17(SOURCE/NC)* 54(GND/NC)*; U2 1(DRAIN/NC)* 16(DRAIN/NC)* 17(SOURCE/NC)* 54(GND/NC)*; U4 2(PC13)* 3(PC14-OSC32_IN)* 4(PC15-OSC32_OUT)* 5(PF0-OSC_IN)* 6(PF1-OSC_OUT)* 8(PC0)* 11(PC3)* 12(PA0) 13(PA1) 18(PA4)* 19(PA5)* 21(PA7)* 23(PC5)* 25(PB1)* 30(PB10)* 33(PB11)* 35(PB13)* 37(PB15)* 39(PC7)* 41(PC9)* 44(PA10)* 46(PA12)* 52(PC10)* 53(PC11)* 54(PC12)* 55(PD2)* 57(PB4)* 58(PB5)* 59(PB6)* 60(PB7)* 62(PB9)*

### Layout directives
differential pair: CSNS_N, CSNS_P, OUT_N, OUT_P, VSNS_N, VSNS_P
net class VIN; net class HighPower: Ctrl_Primary-, Gate_Primary-, VBAT+
net class SW; net class HighPower: SW
net class VOUT; net class HighPower: CSNS_PLPF, HT+, NetC2_1, NetC23_1, NetC23_2, UNFILTERED_OUTPUT

### Notes on the sheet
- (near U3) 3V3 ~50mA
- Voltage Sensing
- C = (Iout * Duty) / (Voltage Ripple * Fsw)
  C = (9 * 0.64) / (12 * 500k) = 922nF
- Gate Drivers & Digital Isolators
- Bootstrapping
- (near C21) Bulk for BSC
- BSC
- High-Side Driver
- (near U2) 5V ~50mA
- 5.1V = 250V * (5000Ohm / 245000Ohm)
- (near U6) 3V3 ~10mA
- PWM w/ TEMP via Duty Cycle
- Skew Control
- (near C25) ~2nH Parasitic
  355GHz Cutoff
  50ns Rise/Fall Time
- Main Connectors
- (near P2) UART Debugging
- (near P1) Flashing/Debug Header
- Input Header
- Output Header
- GND: 150 V/ns
  5V: 100 V/ns
- Low-Side Driver
- (near U5) 3V3 ~10mA
- 5V ~50mA
- ~2nH Parasitic
  355GHz Cutoff
  50ns Rise/Fall Time
- (near U7) COUT ~= (ILOAD * DMAX) / (FSW * DeltaV)
  6.5uF ~= (1A * ~30%) / (55kHz * 1V)
- VDDA x1
- VDD x4
- VREF+ x1
- For Debug LED (PWRGD)
- RIREG
- MCU Pinout
- RTC
- RIREG = (2.5MOhm * Iout * RSNS) / NPS
  63kOhm = (2.5MOhm * 1A * 200mOhm) / 8
- RFB2
- (near R20) RFB1
- RTC = (-RFB2 * 4.1mV/C) / (TCF * NTS)
  92Kohm = (-34kOhm * 4.1mV/C) / -(~1.5mV/C * 1)
- (near R20) RFB2 = RFB1*([(Vout+VF)/1.22V * NTS] - 1)
  33Kohm = 10kOhm * ([(5V-0.7V)/1.22V * 1] - 1)
- (near C64) Enable input to the voltage regulator.
  High = ON and low = OFF.
  Pull this pin high or float to enable the regulator
  Max ON Voltage = 6V
- (in symbol HEATSINK-1) Heatsink
- (in symbol IC_STM32G4, part B) 2 of 2
- (in symbol TRANS-8:1:1-424V-12V) N1; N2; N3

### Library data of the parts
3V3_LDO 5V_BUCK 5V_FLYBACK 5V_TERTIARY 12V_FLYBACK 12V_TERTIARY BOOTSTRAP OUT SW VSNS = TP-Surface-Ring: Test Point Compact SMT Phos Bronze/Silver 1000pc Tape & Reel | Keystone Electronics 5016; SnapEDA_Link: https://www.snapeda.com/parts/5016/Keystone/view-part/?ref=snap; Package: NON STANDARD-1 Keystone; Value: *; MF: Keystone Electronics; MP: 5016; Check_prices: https://www.snapeda.com/parts/5016/Keystone/view-part/?ref=eda
C1 = CAP-470n: 0.47 µF ±10% 630V Ceramic Capacitor X7R 2220 (5750 Metric); Mfr_Name: Kemet; ComponentLink1Description: Datasheet; ComponentLink1URL: https://search.murata.co.jp/Ceramy/image/img/A01X/G101/ENG/GRM55DR7LV474KW01-00B.pdf
C2 C23 = CAP-40u: 40 µF Film Capacitor 600V Polypropylene (PP), Metallized Radial - 4 Leads; Manufacturer: Wurth Elektronik; Match Code: WCAP-FTDB; Dissipation Factor @1kHz: 0.2%; Insulation Resistance: 250MOhm; Pitch: 37.5mm; Rate of Voltage Rise: 30V/us; Technical Reference: MDBP375406J600DCPP15040; Manufacturer Part Number: 890764428004CS; Category: Film Capacitors; ComponentLink1Description: Website Link; ComponentLink1URL: https://www.we-online.com/redexpert/article/890764428004CS?ad; ComponentLink2Description: Datasheet Link; ComponentLink2URL: https://www.we-online.com/redexpert/spec/890764428004CS?ad; Mount: Through Hole; Operating Temperature Max: 105°C; Operating Temperature Min: -40°C; Packaging: Carton; Length: 42mm; Width: 30mm; Height: 45mm; Rated Voltage (DC): 600V
C3 C6 = CAP-33p-1kV: SMD Comm C0G HV, Ceramic, 33 pF, 5%, 1000 VDC, C0G, SMD, MLCC, Ultra-Stable, Low Loss, Class I, 0805; Manufacturer_Name: Kemet; Copyright: Copyright (C) 2025 Ultra Librarian. All rights reserved.; Manufacturer_Part_Number: C0805C330JDGACTU; Datasheet: https://search.kemet.com/download/datasheet/C0805C330JDGAC7800
C4 C63 = CAP-100p: 100 pF ±5% 450V Ceramic Capacitor C0G, NP0 0805 (2012 Metric); Mfr_Name: Yageo; ComponentLink1Description: Datasheet; ComponentLink1URL: https://product.tdk.com/system/files/dam/doc/product/capacitor/ceramic/mlcc/catalog/mlcc_commercial_midvoltage_en.pdf
C5 = CAP-10n: 10000 pF ±10% 500V Ceramic Capacitor X7R 1206 (3216 Metric); Mfr_Name: Yageo; ComponentLink1Description: Datasheet; ComponentLink1URL: https://www.vishay.com/docs/45199/vjcommercialseries.pdf
C7 = CAP-100n-500V: 0.1 µF ±10% 500V Ceramic Capacitor X7R 1210 (3225 Metric); Mfr_Name: Yageo; ComponentLink1Description: Datasheet; ComponentLink1URL: https://search.kemet.com/download/datasheet/C1210C104KCRAC7800
C8-C11 C16-C18 C20 C49 C59 C60 C68 = CAP-0.1U-0001: CAP CER 0.1UF 16V X7R 0402; ComponentLink2Description: Datasheet; ComponentLink2URL: https://www.yageo.com/upload/media/product/productsearch/datasheet/mlcc/UPY-GPHC_X7R_6.3V-to-250V_24.pdf; Device Class: Ceramic; Size: 0402
C12 C30 C31 C42 C50 C66 = CAP-4.7U-0001: CAP CER 4.7UF 25V X5R 0603; Device Class: Ceramic; Size: 0603
C13 C15 C52 C58 C61 = CAP-1U-0002: CAP CER 1UF 16V X7R 0603; Device Class: Ceramic; Size: 0603
C14 C64 = CAP-10N-0002: CAP CER 10000PF 50V X7R 0603; ComponentLink2Description: Datasheet; ComponentLink2URL: http://www.yageo.com/documents/recent/UPY-GPHC_X7R_6.3V-to-50V_18.pdf; Device Class: Ceramic; Size: 0603
C19 C22 = CAP-2.2U-0001: CAP CER 2.2UF 100V X7R 1206; Device Class: Ceramic; Size: 1206; ComponentLink1Description: Datasheet; ComponentLink1URL: https://www.yageo.com/upload/media/product/productsearch/datasheet/mlcc/UPY-GPHC_X7R_6.3V-to-250V_24.pdf
C21 = CAP-40u_25V: 47 µF ±20% 25V Ceramic Capacitor X5R 1206 (3216 Metric); Manufacturer Part Number: 890764428004CS; Manufacturer: Wurth Elektronik; Match Code: WCAP-FTDB; Dissipation Factor @1kHz: 0.2%; Insulation Resistance: 250MOhm; Pitch: 37.5mm; Rate of Voltage Rise: 30V/us; Rated Voltage (DC): 600V; Technical Reference: MDBP375406J600DCPP15040; Category: Film Capacitors; ComponentLink2Description: Datasheet Link; ComponentLink2URL: https://product.tdk.com/system/files/dam/doc/product/capacitor/ceramic/mlcc/catalog/mlcc_commercial_general_en.pdf; Mount: Through Hole; Operating Temperature Max: 105°C; Operating Temperature Min: -40°C; Packaging: Carton; Length: 42mm; Width: 30mm; Height: 45mm
C24 C25 C55 C56 = CAP-100P-0001: CAP CER 100PF 50V C0G/NPO 0402; Device Class: Ceramic; Size: 0402; ComponentLink1Description: Datasheet; ComponentLink1URL: https://www.yageo.com/upload/media/product/productsearch/datasheet/mlcc/UPY-GP_NP0_16V-to-50V_18.pdf
C26 C38 = CAP-1.5n-250V: 1500 pF ±5% 250V Ceramic Capacitor C0G, NP0 0603 (1608 Metric); Manufacturer_Name: Kemet; Manufacturer_Part_Number: C0805C330JDGACTU; Copyright: Copyright (C) 2025 Ultra Librarian. All rights reserved.; Datasheet: 1500 pF ±5% 250V Ceramic Capacitor C0G, NP0 0603 (1608 Metric)
C27 C32 C34 C39 C44 C51 C54 C67 = CAP-100n: 0.1 µF ±10% 50V Ceramic Capacitor X7R 0603 (1608 Metric); Mfr_Name: Yageo; ComponentLink1Description: Datasheet; ComponentLink1URL: https://www.yageo.com/upload/media/product/productsearch/datasheet/mlcc/UPY-GPHC_X7R_6.3V-to-250V_24.pdf
C28 C29 C40 C41 = CAP-1U-0001: CAP CER 1UF 50V X7R 0805; ComponentLink2URL: https://www.yageo.com/upload/media/product/productsearch/datasheet/mlcc/UPY-GPHC_X7R_6.3V-to-250V_24.pdf; ComponentLink2Description: Datasheet; Device Class: Ceramic; Size: 0805
C33 C43 = CAP-1u-200V: 1 µF ±10% 200V Ceramic Capacitor X7R 1812 (4532 Metric); Mfr_Name: Yageo; ComponentLink1Description: Datasheet; ComponentLink1URL: https://datasheets.kyocera-avx.com/KGM_X7R.pdf
C35 C45 = CAP-2.2u-25V: 2.2 µF ±10% 25V Ceramic Capacitor X5R 0402 (1005 Metric); Mfr_Name: Yageo; ComponentLink1Description: Datasheet; ComponentLink1URL: https://search.kemet.com/download/datasheet/C0603C222J2GAC7867
C36 C46 = CAP-47pF-50V: 47 pF ±1% 50V Ceramic Capacitor C0G, NP0 0402 (1005 Metric); Mfr_Name: Yageo; ComponentLink1Description: Datasheet; ComponentLink1URL: https://search.kemet.com/download/datasheet/C0402C470F5GAC7867
C37 C47 = CAP-0.22U-0001: CAP CER 0.22UF 50V X7R 0603; Device Class: Ceramic; Size: 0603; ComponentLink1Description: Datasheet; ComponentLink1URL: https://www.yageo.com/upload/media/product/productsearch/datasheet/mlcc/UPY-GPHC_X7R_6.3V-to-250V_24.pdf
C48 C57 = CAP-10u-25V: 10 µF ±10% 25V Ceramic Capacitor X5R 0603 (1608 Metric); Mfr_Name: Yageo; ComponentLink1Description: Datasheet; ComponentLink1URL: https://search.murata.co.jp/Ceramy/image/img/A01X/G101/ENG/GRM188R61E106KA73-01.pdf
C53 C65 = CAP-10u: 10 µF ±20% 16V Ceramic Capacitor X6S 0603 (1608 Metric); Mfr_Name: Kemet; ComponentLink1Description: Datasheet; ComponentLink1URL: https://search.murata.co.jp/Ceramy/image/img/A01X/G101/ENG/GRM188C81C106MA73-01.pdf
C62 = CAP-330n-500V: 0.33 µF ±10% 500V Ceramic Capacitor X7R 1812 (4532 Metric); Mfr_Name: Yageo; ComponentLink1Description: Datasheet; ComponentLink1URL: https://search.kemet.com/download/datasheet/C1812C334KCRACAUTO
D1 = DIO-ZENER-600: Diode 600 V 12A Through Hole TO-220AC; Mfr_Name: STMicroelectronics; ComponentLink1Description: Datasheet; ComponentLink1URL: https://www.st.com/content/ccc/resource/technical/document/datasheet/cb/a3/4c/74/1c/4a/40/56/CD00002494.pdf/files/CD00002494.pdf/jcr:content/translations/en.CD00002494.pdf
D2 = DIO-TVS-240: 295V (Typ) Clamp 100A Ipp Tvs Diode Surface Mount; ComponentLink1Description: Datasheet; ComponentLink1URL: https://www.bourns.com/docs/product-datasheets/ptvs1-240c-m.pdf
D4 D5 = DIO-ZENER-16V: Zener Diode 16 V 300 mW ±6% Surface Mount SOD-323; Mfr_Name: STMicroelectronics; ComponentLink1Description: Datasheet; ComponentLink1URL: SOD-323_1P8X1P35_ONS-L
J1 = LDO-3v3: Linear Voltage Regulator IC Positive Fixed 1 Output 1.5A 8-SOIC; Package: None; Price: None; Value: *; MP: MCP1727T-3302E/SN; Availability: Unavailable; ComponentLink1Description: Datasheet; ComponentLink1URL: https://ww1.microchip.com/downloads/en/DeviceDoc/21999b.pdf
J2 J3 = CONN-300V-30A-2POS: 6.35mm Pitch Beau Eurostyle Fixed Mount PCB Terminal Block, Modular, 2 Circuits; Manufacturer_Name: Molex Connector Corporation; Type: Headers, Plugs and Sockets; Copyright: Copyright (C) 2025 Ultra Librarian. All rights reserved.; Manufacturer_Part_Number: 393800102; Datasheet: https://www.molex.com/en-us/products/part-detail-pdf/393800102?display=pdf; RefDes: RefDes
J4-J7 = CONN-ThroughHole-2x: 1.07mm Hole Diameter; Manufacturer_Name: Molex Connector Corporation; Manufacturer_Part_Number: 393800102; Type: Headers, Plugs and Sockets; Copyright: Copyright (C) 2025 Ultra Librarian. All rights reserved.; Datasheet: https://www.molex.com/en-us/products/part-detail-pdf/393800102?display=pdf; RefDes: RefDes
K1 = OPTOC-200mA: Optoisolator Darlington Output 3750Vrms 1 Channel 4-SOP; Manufacturer_Name: Renesas Electronics; Copyright: Copyright (C) 2025 Ultra Librarian. All rights reserved.; Manufacturer_Part_Number: PS2702-1-F3-A; RefDes: RefDes; Type: Type; ComponentLink1Description: Datasheet; ComponentLink1URL: https://www.renesas.com/us/en/document/dst/ps2702-1-data-sheet-0
L1 L6 = IND-330u: 330 µH Unshielded Wirewound Inductor 17 A 40mOhm Max Radial, Vertical Cylinder; Mfr_Name: Panasonic; ComponentLink1Description: Datasheet; ComponentLink1URL: https://www.rencousa.com/sites/default/files/productfamilies/pdfs/RL-1256_0.pdf
L2 = IND-33u-32A-6m: WE-HCFT THT High Current Inductor, size 3540, 33µH, 32A; Manufacturer: Wurth Elektronik; Case/Size Code: 3540; DC Resistance: 5.67mΩ; DC Resistance Max: 6.38mΩ; Inductance Tolerance: 20%; Saturation Current: 38.9A; Self Resonant Frequency: 7MHz; Manufacturer Part Number: 7443763540330; Category: Power Inductors; Match Code: WE-HCFT; ComponentLink1Description: Website Link; ComponentLink1URL: https://www.we-online.com/redexpert/article/7443763540330?ad; ComponentLink2Description: Datasheet Link; ComponentLink2URL: https://www.we-online.com/redexpert/spec/7443763540330?ad; Mount: Through Hole; Min Operating Temperature: -40°C; Max Operating Temperature: 125°C; Packaging: Tray; Length: 36mm; Width: 41mm; Height: 35mm; Inductance: 33µH; Rated Current: 32A
L3 L4 = IND-4.7u: 4.7 µH Shielded Inductor 1 A 426mOhm Max 0806 (2016 Metric); ComponentLink1Description: Datasheet; ComponentLink1URL: https://www.cyntec.com/upfile/products/download/SDEM20161T-000%20(A4).pdf
L5 = IND-100u: IHLP-6767GZ-11 100 20% ER E3; Manufacturer_Name: Vishay; Copyright: Copyright (C) 2025 Ultra Librarian. All rights reserved.; Manufacturer_Part_Number: IHLP6767GZER101M11; Datasheet: https://www.vishay.com/doc?34282
P1 = Header 6: Header, 6-Pin; LatestRevisionDate: 17-Jul-2002; LatestRevisionNote: Re-released for DXP Platform.; Publisher: Altium Limited
P2 = Header 4: Header, 4-Pin; LatestRevisionDate: 17-Jul-2002; LatestRevisionNote: Re-released for DXP Platform.; Publisher: Altium Limited
Q2 Q3 = FET-800V-11A: Insulated-Gate Field-Effect Transistor (IGFET), N-Channel, Enhancement, Body Diode, ESD Diode Gate/Source, Pin 1 Gate, 2 Drain, 3 Source, 3 Pins; Manufacturer: Infineon Technologies; PackageReference: PG-TO252-3-342; Manufacturer Order Number: IPD80R450P7; ComponentLink1Description: Datasheet; ComponentLink1URL: https://www.infineon.com/dgdl/Infineon-IPD80R450P7-DS-v02_00-EN.pdf?fileId=5546d4625607bd1301562e3b26963327
R1 = RES-100k-0001: RES SMD 100K OHM 1% 1/10W 0603; Tolerance: 1%; Size: 0603; ComponentLink1Description: Datasheet; ComponentLink1URL: https://www.yageo.com/upload/media/product/products/datasheet/rchip/PYu-RC_Group_51_RoHS_L_12.pdf
R2 R3 = RES-240-2W: 240 Ohms ±1% 2W Chip Resistor 2512 (6332 Metric) Automotive AEC-Q200, Moisture Resistant Thick Film; ComponentLink1Description: Datasheet; ComponentLink1URL: https://www.te.com/commerce/DocumentDelivery/DDEController?Action=srchrtrv&DocNm=9-1773463-5&DocType=DS&DocLang=English
R4 R38 = RES-150k: 150 kOhms ±5% 0.667W, 2/3W Chip Resistor 1206 (3216 Metric) Automotive AEC-Q200, Pulse Withstanding Thick Film; ComponentLink1Description: Datasheet; ComponentLink1URL: https://industrial.panasonic.com/cdbs/www-data/pdf/RDO0000/AOA0000C331.pdf
R5 R6 R8-R11 R33-R35 = RES-0: 0 Ohms Jumper Chip Resistor 0603 (1608 Metric) Moisture Resistant Thick Film; Mfr_Name: Yageo; ComponentLink1Description: Datasheet; ComponentLink1URL: https://www.yageo.com/upload/media/product/products/datasheet/rchip/PYu-RC_Group_51_RoHS_L_12.pdf
R7 R12 = RES-100-0001: RES 100 OHM 1% 1/16W 0402; Tolerance: 1%; Size: 0402; ComponentLink1Description: Datasheet; ComponentLink1URL: https://www.yageo.com/upload/media/product/products/datasheet/rchip/PYu-RC_Group_51_RoHS_L_12.pdf
R13 R21 = RES-39: 39 Ohms ±1% 2W Chip Resistor 2512 (6332 Metric) Pulse Withstanding Thick Film; ComponentLink1Description: Datasheet; ComponentLink1URL: https://www.te.com/usa-en/product-2176331-8.datasheet.pdf
R14 R22 = RES-20k: 20 kOhms ±0.1% 0.063W, 1/16W Chip Resistor 0402 (1005 Metric) Automotive AEC-Q200 Thin Film; ComponentLink1Description: Datasheet; ComponentLink1URL: https://industrial.panasonic.com/cdbs/www-data/pdf/RDM0000/AOA0000C307.pdf
R15 = RES-63.4k: 63.4 kOhms ±1% 0.063W, 1/16W Chip Resistor 0402 (1005 Metric) Moisture Resistant Thick Film; ComponentLink1Description: Datasheet; ComponentLink1URL: https://www.yageo.com/upload/media/product/products/datasheet/rchip/PYu-RC_Group_51_RoHS_L_12.pdf
R16 = RES-200m: 200 mOhms ±5% 2W Chip Resistor 2512 (6432 Metric) Current Sense Thick Film; ComponentLink1Description: Datasheet; ComponentLink1URL: https://www.bourns.com/docs/product-datasheets/crm.pdf
R17 R20 R25 R28 = RES-10k_1/16W: 10 kOhms ±1% 0.063W, 1/16W Chip Resistor 0402 (1005 Metric) Automotive AEC-Q200 Thick Film; ComponentLink1Description: Datasheet; ComponentLink1URL: https://www.vishay.com/docs/20035/dcrcwe3.pdf
R18 R27 = RES-92k: 92 kOhms ±0.1% 0.063W, 1/16W Chip Resistor 0402 (1005 Metric) Thin Film; ComponentLink1Description: Datasheet; ComponentLink1URL: https://www.yageo.com/upload/media/product/app/datasheet/rchip/pyu-rt_1-to-0.01_rohs_l.pdf
R19 = RES-34k: 34 kOhms ±1% 0.1W, 1/10W Chip Resistor 0402 (1005 Metric) Automotive AEC-Q200 Thick Film; ComponentLink1Description: Datasheet; ComponentLink1URL: https://industrial.panasonic.com/cdbs/www-data/pdf/RDA0000/AOA0000C304.pdf
R23 = RES-47k: 47 kOhms ±1% 0.1W, 1/10W Chip Resistor 0402 (1005 Metric) Automotive AEC-Q200 Thick Film; ComponentLink1Description: Datasheet; ComponentLink1URL: https://industrial.panasonic.com/cdbs/www-data/pdf/RDA0000/AOA0000C304.pdf
R24 = RES-300m: 300 mOhms ±1% 2W Chip Resistor 2512 (6432 Metric) Automotive AEC-Q200, Current Sense Thick Film; ComponentLink1Description: Datasheet; ComponentLink1URL: https://www.seielect.com/catalog/sei-csr_csrn.pdf
R26 = RES-25k: 25 kOhms ±0.1% 0.15W Chip Resistor 0603 (1608 Metric) Anti-Sulfur, Moisture Resistant, Non-Inductive, Non-Magnetic Thin Film; ComponentLink1Description: Datasheet; ComponentLink1URL: https://www.vishay.com/docs/60057/pnm.pdf
R29 R32 = RES-4.7k-0001: RES 4.7K OHM 1% 1/10W 0603; Tolerance: 1%; Size: 0603; ComponentLink1Description: Datasheet; ComponentLink1URL: https://www.yageo.com/upload/media/product/products/datasheet/rchip/PYu-RC_Group_51_RoHS_L_12.pdf
R30 = RES-240k-2/3W: 240 kOhms ±1% 0.667W, 2/3W Chip Resistor 1206 (3216 Metric) Automotive AEC-Q200, Pulse Withstanding Thick Film; ComponentLink1Description: Datasheet; ComponentLink1URL: https://industrial.panasonic.com/cdbs/www-data/pdf/RDO0000/AOA0000C331.pdf
R31 = RES-5k-1/4W: 5 kOhms ±0.1% 0.25W, 1/4W Chip Resistor 1206 (3216 Metric) Thin Film; ComponentLink1Description: Datasheet; ComponentLink1URL: https://www.yageo.com/upload/media/product/app/datasheet/rchip/pyu-rt_1-to-0.01_rohs_l.pdf
R36 = RES-380-1/10W: 379 Ohms ±0.5% 0.1W, 1/10W Chip Resistor 0603 (1608 Metric) Automotive AEC-Q200, Moisture Resistant Metal Film; Package: None; Price: None; Value: *; MP: RN73H1JTTD3790D100; Availability: Unavailable; ComponentLink1Description: Datasheet; ComponentLink1URL: https://www.koaspeer.com/pdfs/RN73H.pdf
R37 = RES-125k: 150 kOhms ±5% 0.667W, 2/3W Chip Resistor 1206 (3216 Metric) Automotive AEC-Q200, Pulse Withstanding Thick Film; ComponentLink1Description: Datasheet; ComponentLink1URL: https://industrial.panasonic.com/cdbs/www-data/pdf/RDO0000/AOA0000C331.pdf
R39 R40 = RES-10: 10 Ohms ±1% 1W Chip Resistor 2512 (6332 Metric) Moisture Resistant Thick Film; ComponentLink1Description: Datasheet; ComponentLink1URL: https://www.yageo.com/upload/media/product/products/datasheet/rchip/PYu-RC_Group_51_RoHS_L_12.pdf
T1 T2 = TRANS-8:1:1-424V-12V: WE-OLLT Offline Flyback Transformer, THT, RM10, Ui = 71 - 424V, Uo = 12V / 3A; Manufacturer: Wurth Elektronik; Inductance: 670uH; Input Voltage: 71 - 424V (AC); Insulation Test Voltage: 3000V (AC); Switching Frequency: 140kHz; Manufacturer Part Number: 750317589; Category: Transformers For AC-DC Converter; Match Code: WE-OLLT; ComponentLink1Description: Website Link; ComponentLink1URL: https://www.we-online.com/redexpert/article/750317589?ad; ComponentLink2Description: Datasheet Link; ComponentLink2URL: https://www.we-online.com/redexpert/spec/750317589?ad; Mount: Through Hole; Operating Temperature Max: 125°C; Operating Temperature Min: -40°C; Packaging: Tray; Case/Size Code: RM10; Length: 31.5mm; Width: 31.5mm; Height: 20.5mm; Auxiliary Voltage: 12V; Output Current: 3A; Output Voltage: 12V; Saturation Current: 3A
TH1 TH2 = NTC-3Ohm-40A: Inrush Current Limiter 3 Ohms 30 A 1.378" (35.00mm); Manufacturer_Name: Ametherm; Copyright: Copyright (C) 2025 Ultra Librarian. All rights reserved.; Manufacturer_Part_Number: MS35 3R030; ComponentLink1Description: Datasheet; ComponentLink1URL: https://www.ametherm.com/datasheetspdf/MS353R030.pdf
U1 U2 = FET-600V-55A: Power Switch/Driver 1:1 N/P-Channel 40A 54-VQFN (12x12); Mfr_Name: Texas Instruments; TYPE: TYPE; RefDes: RefDes; ComponentLink1Description: Datasheet; ComponentLink1URL: https://www.ti.com/lit/ds/symlink/lmg3422r030.pdf
U3 = IC-CURRSENSE: Current Sensor 15A 1 Channel Hall Effect Bidirectional 16-SOIC (0.295", 7.50mm Width); Mfr_Name: Allegro Microsystems Inc.; RefDes: RefDes; Type: Type; ComponentLink1Description: Datasheet; ComponentLink1URL: https://www.allegromicro.com/-/media/files/datasheets/acs37002-datasheet.pdf
U4 = IC_STM32G4: ARM® Cortex®-M4F STM32G4 Microcontroller IC 32-Bit Single-Core 170MHz 512KB (512K x 8) FLASH 64-LQFP (10x10); Mfr_Name: STMicroelectronics; RefDes: RefDes; Type: Type; ComponentLink1Description: Datasheet; ComponentLink1URL: https://www.st.com/resource/en/datasheet/stm32g474cb.pdf
U5 U6 = IC-DIGITAL-ISO-4CH: General Purpose Digital Isolator 3000Vrms 4 Channel 100Mbps 85kV/µs CMTI 16-SSOP (0.154", 3.90mm Width); Mfr_Name: Texas Instruments; TYPE: TYPE; RefDes: RefDes; ComponentLink1Description: Datasheet; ComponentLink1URL: https://www.ti.com/general/docs/suppproductinfo.tsp?distId=10&gotoUrl=https%3A%2F%2Fwww.ti.com%2Flit%2Fgpn%2Fiso7742
U7 U9 U10 U12 = DIO-SCHOT-1.4A: Diode 40 V 1.4A Surface Mount DO-214AC (SMA); Mfr_Name: Comchip; ComponentLink1Description: Datasheet; ComponentLink1URL: https://www.comchiptech.com/admin/files/product/CDBA140SL-HF%20RevD951086.pdf
U8 U11 = IC-FLYBACK: Buck, Boost, Flyback Regulator Positive Output Step-Up, Step-Down DC-DC Controller IC 20-TSSOP-EP; Mfr_Name: Analog Devices Inc; Type: Power Management; RefDes: RefDes; ComponentLink1Description: Datasheet; ComponentLink1URL: https://www.analog.com/media/en/technical-documentation/data-sheets/LT8316.pdf
U13 = DIO-SCHOT-650V-1A: Diode 650 V 1A Surface Mount DO-214AA; Mfr_Name: Comchip; ComponentLink1Description: Datasheet; ComponentLink1URL: https://genesicsemi.com/sic-schottky-mps/GB01SLT06-214/GB01SLT06-214.pdf
U14 = IC-VOLT-SENSE: 0-V to 5-V input, precision voltage sensing reinforced isolated amplifier 8-SOIC -40 to 125; Manufacturer_Name: Texas Instruments; Type: Linear; Copyright: Copyright (C) 2025 Ultra Librarian. All rights reserved.; Manufacturer_Part_Number: AMC1351DWV; Datasheet: https://www.ti.com/lit/gpn/amc1351; RefDes: RefDes; ComponentLink1Description: https://mm.digikey.com/Volume0/opasdata/d220001/medias/docus/6130/amc1351.pdf; ComponentLink1URL: *
U15 = DIO-SCHOT-20V-1A: Diode 20 V 1A Surface Mount DO-214AC (SMA); Mfr_Name: Comchip; ComponentLink1Description: Datasheet; ComponentLink1URL: https://diotec.com/request/datasheet/sk12.pdf
U16 = IC-BUCK-12V-5V-1: SIMPLE SWITCHER&reg; 40V, 500mA Low Component Count Step-Down Regulator 8-SOIC -40 to 125; MF: Texas Instruments; MP: LM2674MX-5.0/NOPB; Price: None; Purchase-URL: https://pricing.snapeda.com/search/part/LM2674MX-5.0/NOPB/?ref=eda; Package: SOIC-8 Texas Instruments; Check_prices: https://www.snapeda.com/parts/LM2674MX-5.0/NOPB/Texas%20Instruments/view-part/1037916/?ref=eda; Value: *; Availability: Good; SnapEDA_Link: https://www.snapeda.com/parts/LM2674MX-5.0/NOPB/Texas%20Instruments/view-part/1037916/?ref=snap; ComponentLink1Description: Datasheet; ComponentLink1URL: https://www.ti.com/general/docs/suppproductinfo.tsp?distId=10&gotoUrl=https%3A%2F%2Fwww.ti.com%2Flit%2Fgpn%2Flm2674
U17 = RELAY-12V-30A: RELAY AUTOMOTIVE SPST 30A 12V; Manufacturer_Name: Panasonic; Copyright: Copyright (C) 2025 Ultra Librarian. All rights reserved.; Manufacturer_Part_Number: ACNH3212; RefDes: RefDes; Type: Type; ComponentLink1Description: Datasheet; ComponentLink1URL: https://api.pim.na.industrial.panasonic.com/file_stream/main/fileversion/246796

## Assembly variants
DNP: not fitted R8 R10